# Altium schematic sheet amplifier.SchDoc
size A4
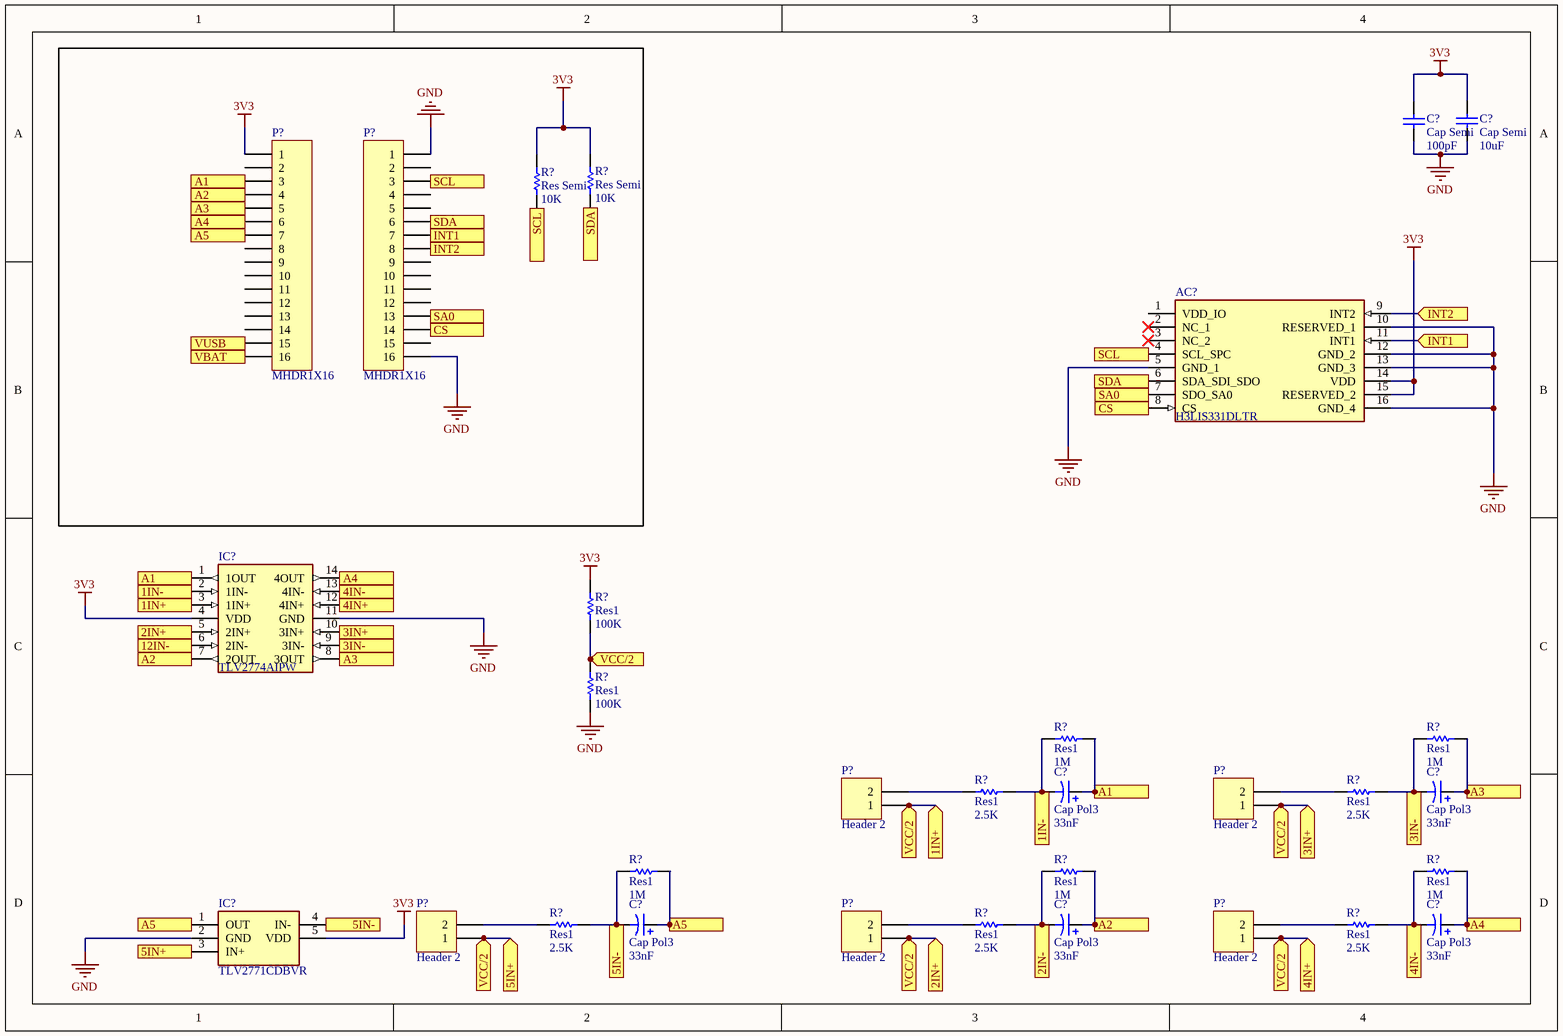
[diagram p0: amplifier.SchDoc]

## Parts
(Parts that share a designator on the sheet are numbered #1, #2 ... from top to bottom, then left to right.)
AC?  H3LIS331DLTR  [PQFN50P300X300X100-16N]
C?#1  Cap Semi  value 100pF  [C1206]
C?#2  Cap Semi  value 10uF  [C1206]
C?#3  Cap Pol3  value 33nF  [C0805]
C?#4  Cap Pol3  value 33nF  [C0805]
C?#5  Cap Pol3  value 33nF  [C0805]
C?#6  Cap Pol3  value 33nF  [C0805]
C?#7  Cap Pol3  value 33nF  [C0805]
IC?#1  TLV2774AIPW  [SOP65P640X120-14N]
IC?#2  TLV2771CDBVR  [SOT95P280X145-5N]
P?#1  MHDR1X16  [MHDR1X16]
P?#2  MHDR1X16  [MHDR1X16]
P?#3  Header 2  [HDR1X2]
P?#4  Header 2  [HDR1X2]
P?#5  Header 2  [HDR1X2]
P?#6  Header 2  [HDR1X2]
P?#7  Header 2  [HDR1X2]
R?#1  Res Semi  value 10K  [AXIAL-0.5]
R?#2  Res Semi  value 10K  [AXIAL-0.5]
R?#3  Res1  value 100K  [AXIAL-0.3]
R?#4  Res1  value 100K  [AXIAL-0.3]
R?#5  Res1  value 1M  [AXIAL-0.3]
R?#6  Res1  value 1M  [AXIAL-0.3]
R?#7  Res1  value 2.5K  [AXIAL-0.3]
R?#8  Res1  value 2.5K  [AXIAL-0.3]
R?#9  Res1  value 1M  [AXIAL-0.3]
R?#10  Res1  value 1M  [AXIAL-0.3]
R?#11  Res1  value 1M  [AXIAL-0.3]
R?#12  Res1  value 2.5K  [AXIAL-0.3]
R?#13  Res1  value 2.5K  [AXIAL-0.3]
R?#14  Res1  value 2.5K  [AXIAL-0.3]

## Ports
1IN+ (in), 1IN- (in), 2IN+ (in), 2IN- (in), 3IN+ (in), 3IN- (in), 4IN+ (in), 4IN- (in), 5IN+ (in), 5IN- (in), 12IN- (in), A1 (in), A2 (in), A3 (in), A4 (in), A5 (in), CS (in), INT1 (in), INT2 (in), SA0 (in), SCL (in), SDA (in), VBAT (out), VCC/2 (in), VUSB (out)

## Nets
3V3: AC?.14(VDD) AC?.15(RESERVED_2) C?#1.2 C?#2.2 IC?#1.4(VDD) IC?#2.5(VDD) P?#1.1 R?#1.1 R?#2.2 R?#3.1
GND: AC?.5(GND_1) AC?.10(RESERVED_1) AC?.12(GND_2) AC?.13(GND_3) AC?.16(GND_4) C?#1.1 C?#2.1 IC?#1.11(GND) IC?#2.2(GND) P?#2.1 P?#2.16 R?#4.2
1IN+: IC?#1.3(1IN+) IC?#1.5(2IN+) IC?#1.10(3IN+) IC?#1.12(4IN+) IC?#2.3(IN+) P?#3.1 P?#4.1 P?#5.1 P?#6.1 P?#7.1 R?#3.2 R?#4.1 ; port 1IN+, port 2IN+, port 3IN+, port 4IN+, port VCC/2, port 5IN+
1IN-: C?#3.2 IC?#1.2(1IN-) R?#5.2 R?#7.1 ; port 1IN-
2IN-: C?#6.2 R?#10.2 R?#13.1 ; port 2IN-
3IN-: C?#4.2 IC?#1.9(3IN-) R?#6.2 R?#8.1 ; port 3IN-
4IN-: C?#7.2 IC?#1.13(4IN-) R?#11.2 R?#14.1 ; port 4IN-
5IN-: C?#5.2 IC?#2.4(IN-) R?#9.2 R?#12.1 ; port 5IN-
12IN-: IC?#1.6(2IN-) ; port 12IN-
A1: C?#3.1 IC?#1.1(1OUT) P?#1.3 R?#5.1 ; port A1
A2: C?#6.1 IC?#1.7(2OUT) P?#1.4 R?#10.1 ; port A2
A3: C?#4.1 IC?#1.8(3OUT) P?#1.5 R?#6.1 ; port A3
A4: C?#7.1 IC?#1.14(4OUT) P?#1.6 R?#11.1 ; port A4
A5: C?#5.1 IC?#2.1(OUT) P?#1.7 R?#9.1 ; port A5
CS: AC?.8(CS) P?#2.14 ; port CS
INT1: AC?.11(INT1) P?#2.7 ; port INT1
INT2: AC?.9(INT2) P?#2.8 ; port INT2
SA0: AC?.7(SDO_SA0) P?#2.13 ; port SA0
SCL: AC?.4(SCL_SPC) P?#2.3 R?#1.2 ; port SCL
SDA: AC?.6(SDA_SDI_SDO) P?#2.6 R?#2.1 ; port SDA
VBAT: P?#1.16 ; port VBAT
VUSB: P?#1.15 ; port VUSB
NetP?#3_2: P?#3.2 R?#7.2
NetP?#4_2: P?#4.2 R?#8.2
NetP?#5_2: P?#5.2 R?#12.2
NetP?#6_2: P?#6.2 R?#13.2
NetP?#7_2: P?#7.2 R?#14.2

Not connected (* = marked no-connect by the designer): AC? 1(VDD_IO) 2(NC_1)* 3(NC_2)*; P?#1 2 8 9 10 11 12 13 14; P?#2 2 4 5 9 10 11 12 15

## Library data of the parts
AC? = H3LIS331DLTR: Accelerometer; Manufacturer_Name: STMicroelectronics; Datasheet Link: http://www.st.com/st-web-ui/static/active/en/resource/technical/document/datasheet/DM00053090.pdf; Height: 1mm; Manufacturer_Part_Number: H3LIS331DLTR; Mouser Part Number: 511-H3LIS331DLTR; Mouser Price/Stock: https://www.mouser.com/Search/Refine.aspx?Keyword=511-H3LIS331DLTR; RS Part Number: 1106549P; RS Price/Stock: http://uk.rs-online.com/web/p/products/1106549P
C?#1 C?#2 = Cap Semi: Capacitor (Semiconductor SIM Model); Published: 8-Jun-2000; LatestRevisionDate: 29-May-2009; LatestRevisionNote: IPC-7351 Footprint Added.; PackageReference: C1206; Publisher: Altium Limited; PackageDescription: Chip Capacitor
C?#3-C?#7 = Cap Pol3: Polarized Capacitor (Surface Mount); Published: 8-Jun-2000; LatestRevisionDate: 29-May-2009; LatestRevisionNote: IPC-7351 Footprint Added.; PackageReference: C0805; Publisher: Altium Limited; PackageDescription: Chip Capacitor
IC?#1 = TLV2774AIPW: Integrated Circuit; Manufacturer_Name: Texas Instruments; Datasheet Link: http://www.ti.com/lit/ds/symlink/tlv2774a.pdf; Height: 1.2mm; Manufacturer_Part_Number: TLV2774AIPW; RS Part Number: 4625114; RS Price/Stock: https://uk.rs-online.com/web/p/products/4625114
IC?#2 = TLV2771CDBVR: Integrated Circuit; Manufacturer_Name: Texas Instruments; Datasheet Link: http://www.ti.com/lit/gpn/tlv2771; Manufacturer_Part_Number: TLV2771CDBVR; Mouser Part Number: 595-TLV2771CDBVR; Mouser Price/Stock: https://www.mouser.com/Search/Refine.aspx?Keyword=595-TLV2771CDBVR
P?#1 P?#2 = MHDR1X16: Header, 16-Pin; LatestRevisionDate: 17-Jul-2002; LatestRevisionNote: Re-released for DXP Platform.; Publisher: Altium Limited
P?#3-P?#7 = Header 2: Header, 2-Pin; LatestRevisionDate: 17-Jul-2002; LatestRevisionNote: Re-released for DXP Platform.; Publisher: Altium Limited
R?#1 R?#2 = Res Semi: Semiconductor Resistor; Published: 8-Jun-2000; LatestRevisionDate: 17-Jul-2002; LatestRevisionNote: Re-released for DXP Platform.; PackageReference: AXIAL-0.5; Publisher: Altium Limited; PackageDescription: Axial Device, Thru-Hole; 2 Leads; 0.5 in Pin Spacing
R?#3-R?#14 = Res1: Resistor; Published: 8-Jun-2000; LatestRevisionDate: 17-Jul-2002; LatestRevisionNote: Re-released for DXP Platform.; PackageReference: AXIAL-0.3; Publisher: Altium Limited; PackageDescription: Axial Device, Thru-Hole; 2 Leads; 0.3 in Pin Spacing